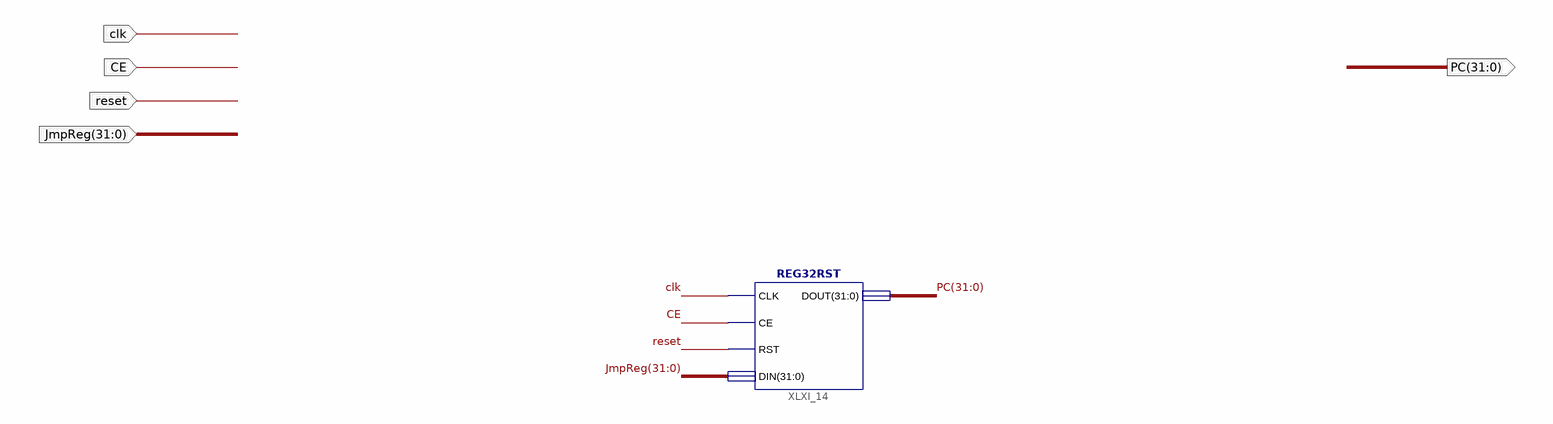
[diagram p0: schematic sheet 1]
// Xilinx ISE schematic Program_Counter.sch (spartan6) as structural Verilog: 1 symbols, 5 ports
module Program_Counter (
  input  clk,
  input  CE,
  input  reset,
  input  [31:0] JmpReg,
  output [31:0] PC
);

  REG32RST XLXI_14 (.CLK(clk), .CE(CE), .RST(reset), .DIN(JmpReg), .DOUT(PC));
endmodule
